# EAGLE board b0_comp (EAGLE 6.4), part 1 of 2
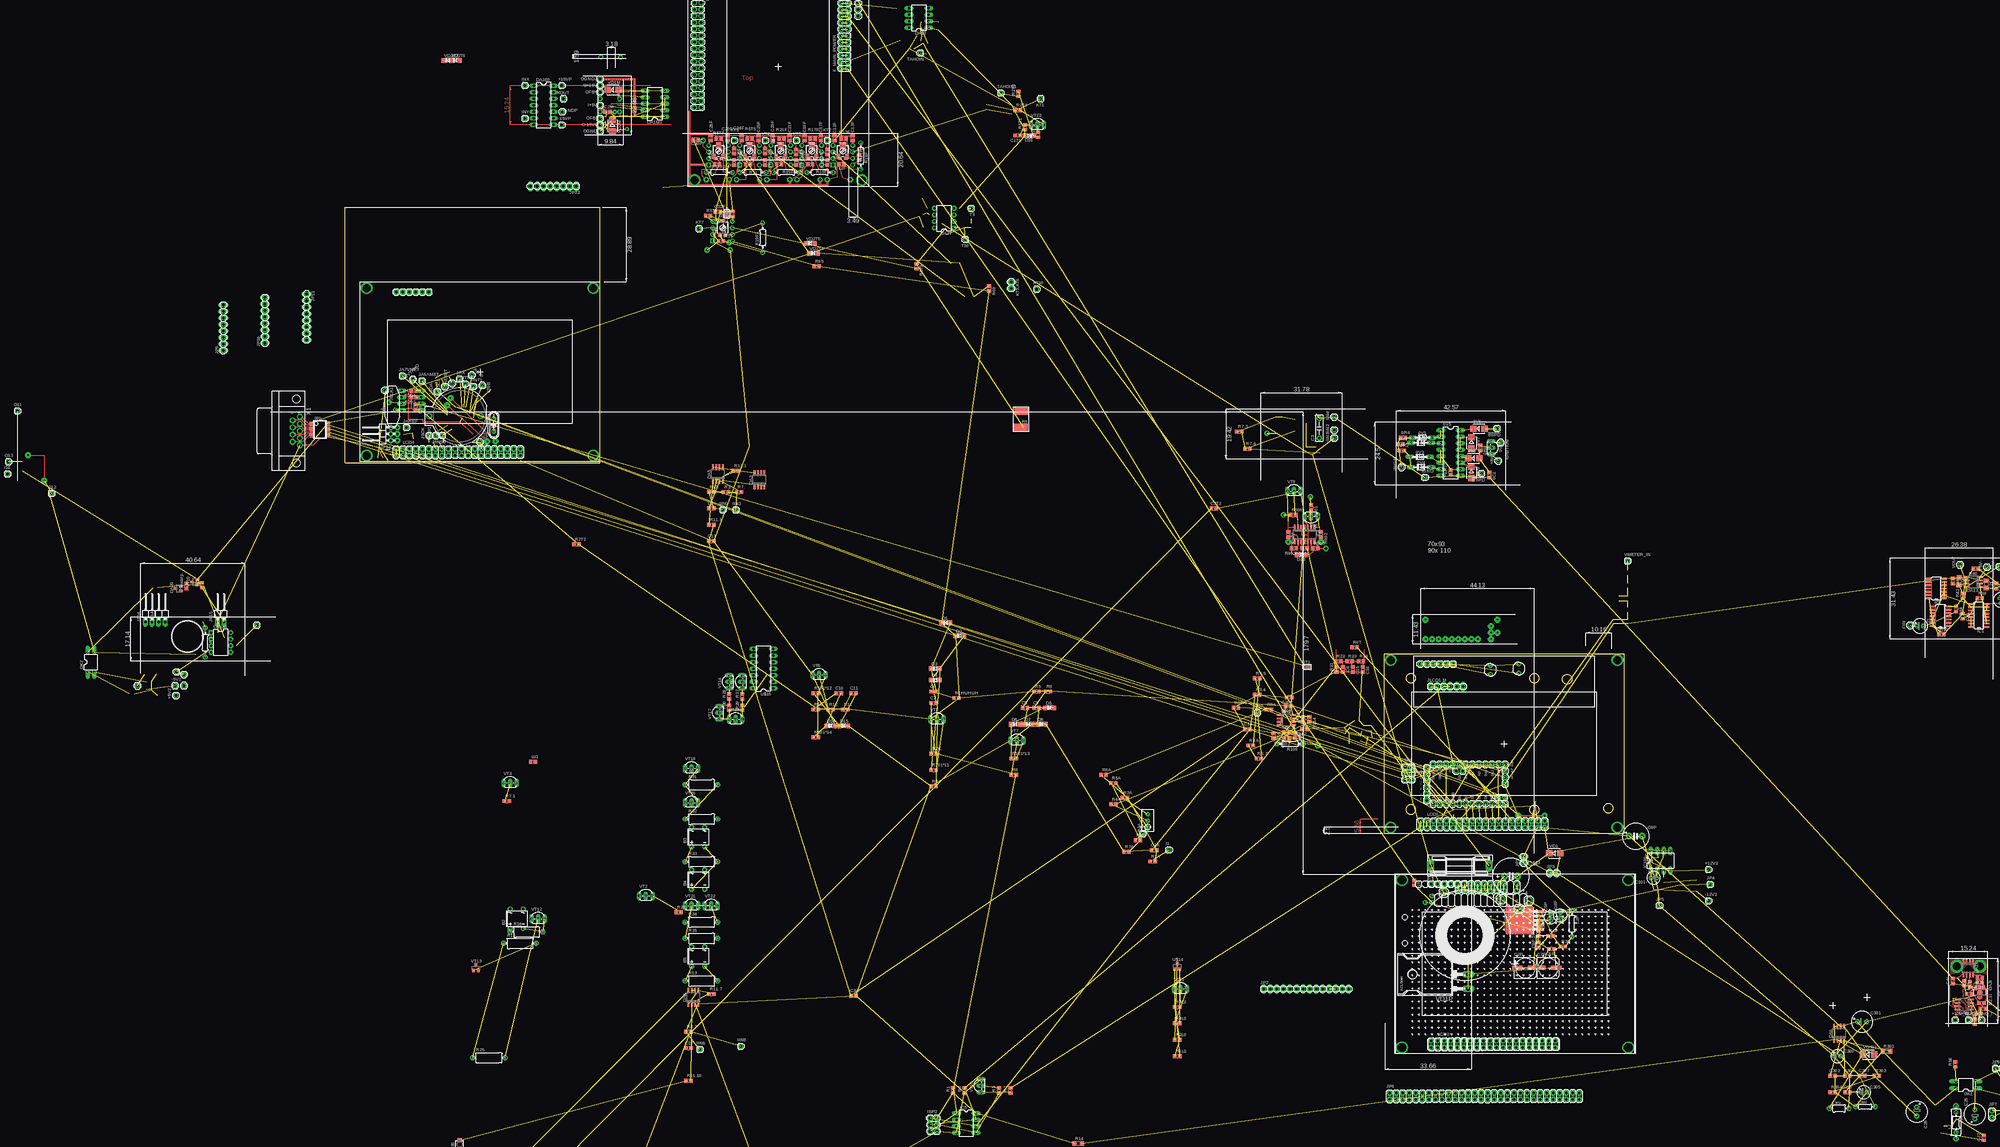
[diagram p12: board, top side]
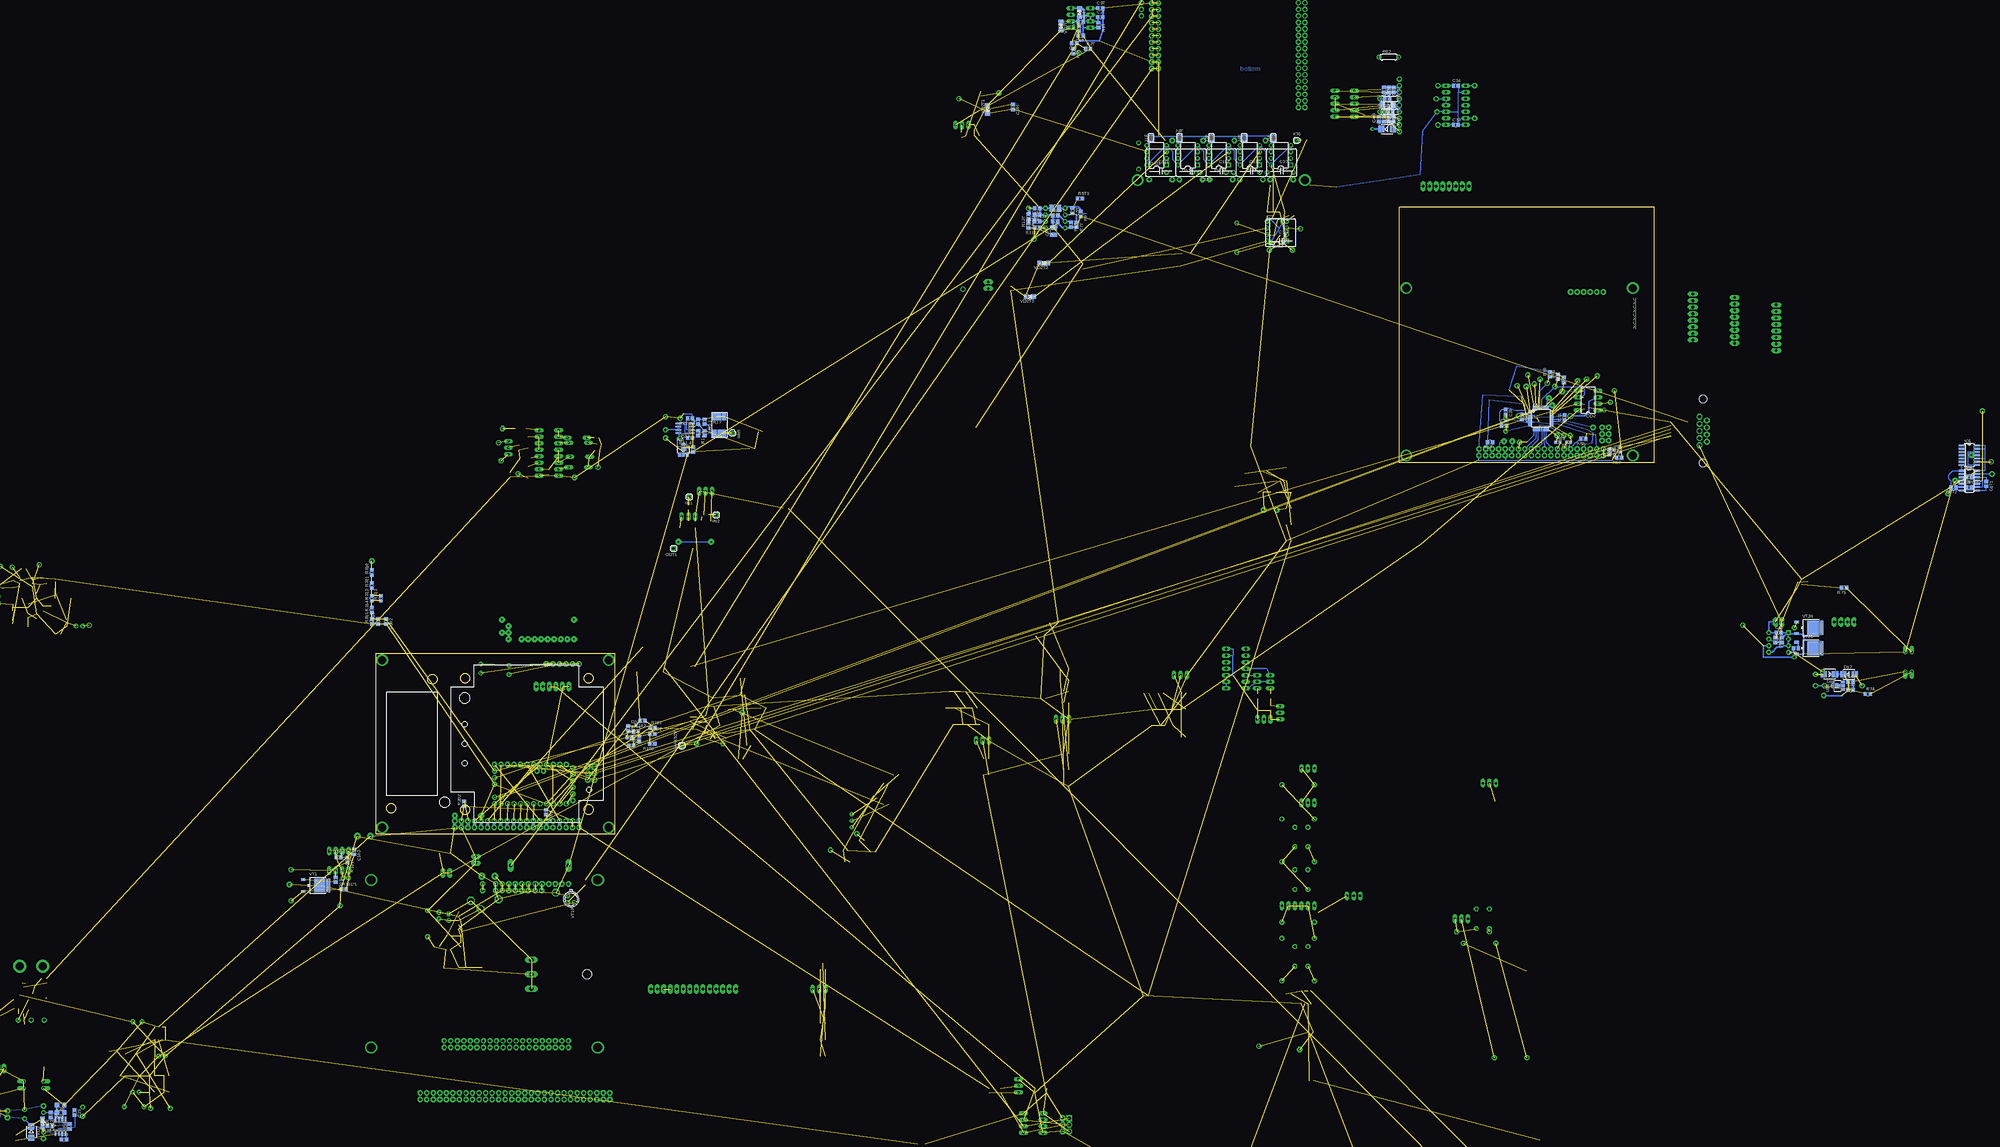
[diagram p13: board, bottom side, seen from below]

Size 496.72 x 243.28 mm. Coordinates in mm from the lower left corner, seen from the top.
Outline: 403.72,70 496.72,70 496.72,0 403.72,0 403.72,70
Outline: circle at 474.72,60 radius 1.8
Outline: circle at 490.72,10 radius 1.8
Outline: circle at 414.02,9.5 radius 1.8
Outline: circle at 414.02,60.5 radius 1.8
Outline: circle at 462.02,60.5 radius 1.8
Outline: circle at 461.91,9.38 radius 1.8
Copper layers (1*16): Top 0.035mm / dielectric 1.5mm / Bottom 0.035mm
Design rules "DesignRules": minimum track width 8mil, minimum drill 24mil, track to track 0.2mm, track to pad 0.2mm, pad to pad 8mil, via to via 8mil, smd to smd 8mil, copper to edge 10mil, drill to drill 8mil, minimum pad ring 0.5mm, minimum via ring 8mil, stop-mask expansion 4mil, vias tented up to drill 0mil, thermal gap 10mil

## Footprints (pad centres in the part's own frame; a part is rotated, then mirrored left to right if it is on the bottom)
C0805 = smd 1.3 x 1.5: 1 -0.95,0; 2 0.95,0
R0805 = smd 1.3 x 1.5: 1 -0.95,0; 2 0.95,0
DO34Z7 = drill 0.813 long: A 3.81,0; C -3.81,0
DIL16 = drill 0.813 long: 1 -8.89,-3.81; 2 -6.35,-3.81; 3 -3.81,-3.81; 4 -1.27,-3.81; 5 1.27,-3.81; 6 3.81,-3.81; 7 6.35,-3.81; 8 8.89,-3.81; 9 8.89,3.81; 10 6.35,3.81; 11 3.81,3.81; 12 1.27,3.81; 13 -1.27,3.81; 14 -3.81,3.81; 15 -6.35,3.81; 16 -8.89,3.81
SMB = smd 2.4 x 2.4: A 2.2,0; C -2.2,0
TO92 = drill 0.813 long: 1 -2.54,-1.27; 2 0,-1.27; 3 2.54,-1.27
PIN-2MM = drill 2 octagon: 1 0,0
1X01 = drill 1.016 octagon: 1 0,0
2X01 = drill 1.016 octagon: 1 -1.27,-1.27; 2 -1.27,1.27
ARDUINO_PRO_MINI = drill 1: A0 11.43,-8.89; A1 11.43,-6.35; A2 11.43,-3.81; A3 11.43,-1.27; A4 8.89,-2.54; A5 8.89,0; A6 6.35,-19.05; A7 8.89,-19.05; BLK 10.16,11.43; D2 -3.81,-1.27; D3 -3.81,-3.81; D4 -3.81,-6.35; D5 -3.81,-8.89; D6 -3.81,-11.43; D7 -3.81,-13.97; D8 -3.81,-16.51; D9 -3.81,-19.05; D10 11.43,-19.05; D11 11.43,-16.51; D12 11.43,-13.97; D13 11.43,-11.43; DTR -2.54,11.43; GND -3.81,1.27; GND@1 11.43,6.35; GND@2 7.62,11.43; GND@3 3.81,-19.05; RAW 11.43,8.89; RST 11.43,3.81; RST@1 -3.81,3.81; RX -3.81,6.35; RX@1 2.54,11.43; TX -3.81,8.89; TX@1 0,11.43; VCC 11.43,1.27; VCC@1 5.08,11.43
DB = drill 0.813: + -2.54,-3.81 | drill 0.813 octagon: - 2.54,-3.81; AC1 2.54,3.81; AC2 -2.54,3.81
BATTERY-AA = drill 1.854: GND@1 25.146,0; GND@2 17.78,0; PWR@1 -25.146,0; PWR@2 -17.78,0
BATTCOM_20MM_PTH = drill 1.3: 1 11.85,0; 2 -8.15,0
E5-13 = drill 1.016 pad 2.54: + -2.54,0 | drill 1.016 pad 2.54 octagon: - 2.54,0
153CLV-0807 = smd 4 x 1.6: + 3.05,0; - -3.05,0
C075-032X103 = drill 0.914 octagon: 1 -3.81,0; 2 3.81,0
E2,5-5 = drill 0.813 pad 1.6: + -1.27,0 | drill 0.813 pad 1.6 octagon: - 1.27,0
C3225 = smd 1.6 x 2.7: 1 -1.4,0; 2 1.4,0
E5-10,5 = drill 1.016 pad 2.54: + -2.54,0 | drill 1.016 pad 2.54 octagon: - 2.54,0
C90-065X115H = drill 1.016 octagon: 1 -4.44,-0.002; 2 4.52,-0.002
C1206 = smd 1.6 x 1.8: 1 -1.4,0; 2 1.4,0
E2,5-6 = drill 0.813 pad 1.6: + -1.27,0 | drill 0.813 pad 1.6 octagon: - 1.27,0
E3,5-8 = drill 0.813 pad 1.6: + -1.778,0 | drill 0.813 pad 1.6 octagon: - 1.778,0
E2-5 = drill 0.813 pad 1.27: + -1.016,0 | drill 0.813 pad 1.27 octagon: - 1.016,0
SOD80C = smd 1.4 x 1.8: A 1.7,0; C -1.7,0
SOT-23 = smd 1 x 1.4: 1 -0.95,-1.1; 2 0.95,-1.1; 3 0,1.1
DIL8 = drill 0.813 square: 1 -3.81,-3.81 | drill 0.813: 2 -1.27,-3.81; 3 1.27,-3.81; 4 3.81,-3.81; 5 3.81,3.81; 6 1.27,3.81; 7 -1.27,3.81; 8 -3.81,3.81
SOIC8 = smd 0.6 x 2.2: 1 -1.905,-2.6; 2 -0.635,-2.6; 3 0.635,-2.6; 4 1.905,-2.6; 5 1.905,2.6; 6 0.635,2.6; 7 -0.635,2.6; 8 -1.905,2.6
MSOP10 = smd 0.3 x 1.02: 1 -1,-2.4; 2 -0.5,-2.4; 3 0,-2.4; 4 0.5,-2.4; 5 1,-2.4; 6 1,2.4; 7 0.5,2.4; 8 0,2.4; 9 -0.5,2.4; 10 -1,2.4
DIL10 = drill 0.813 long: 1 -5.08,-3.81; 2 -2.54,-3.81; 3 0,-3.81; 4 2.54,-3.81; 5 5.08,-3.81; 6 5.08,3.81; 7 2.54,3.81; 8 0,3.81; 9 -2.54,3.81; 10 -5.08,3.81
TO263-5 = smd 1.067 x 2.159: 1 -3.404,-5.791; 2 -1.702,-5.791; 3 0,-5.791; 4 1.702,-5.791; 5 3.404,-5.791 | smd 10.8 x 10.41: 6 0,2.54
DIL-08 = drill 0.813 long: 1 -3.81,-3.81; 2 -1.27,-3.81; 3 1.27,-3.81; 4 3.81,-3.81; 5 3.81,3.81; 6 1.27,3.81; 7 -1.27,3.81; 8 -3.81,3.81
SO08 = smd 0.6 x 2.2: 1 -1.905,-2.6; 2 -0.635,-2.6; 3 0.635,-2.6; 4 1.905,-2.6; 5 1.905,2.6; 6 0.635,2.6; 7 -0.635,2.6; 8 -1.905,2.6
DIL08 = drill 0.813 pad 1.27: 1 -3.81,-3.81; 2 -1.27,-3.81; 3 1.27,-3.81; 4 3.81,-3.81; 5 3.81,3.81; 6 1.27,3.81; 7 -1.27,3.81; 8 -3.81,3.81
SOT89 = smd 1 x 1.5: 1 -1.499,-1.981; 3 1.499,-1.981 | smd 1 x 2: 2 0,-1.727 | smd 2.2 x 3.7: 2@1 0,0.94
DIL14 = drill 0.813 long: 1 -7.62,-3.81; 2 -5.08,-3.81; 3 -2.54,-3.81; 4 0,-3.81; 5 2.54,-3.81; 6 5.08,-3.81; 7 7.62,-3.81; 8 7.62,3.81; 9 5.08,3.81; 10 2.54,3.81; 11 0,3.81; 12 -2.54,3.81; 13 -5.08,3.81; 14 -7.62,3.81
SSOP20D8 = smd 0.305 x 1.245: 1 -2.794,-3.353; 2 -2.159,-3.353; 3 -1.524,-3.353; 4 -0.889,-3.353; 5 -0.254,-3.353; 6 0.381,-3.353; 7 1.016,-3.353; 8 1.651,-3.353; 9 2.286,-3.353; 10 2.921,-3.353; 11 2.921,3.251; 12 2.286,3.251; 13 1.651,3.251; 14 1.016,3.251; 15 0.381,3.251; 16 -0.254,3.251; 17 -0.889,3.251; 18 -1.524,3.251; 19 -2.159,3.251; 20 -2.794,3.251
DIL08' = drill 0.813 long: 1 -3.81,-3.81; 2 -1.27,-3.81; 3 1.27,-3.81; 4 3.81,-3.81; 5 3.81,3.81; 6 1.27,3.81; 7 -1.27,3.81; 8 -3.81,3.81
SH22,5 = drill 1.321 pad 2.54 long: 1 -11.252,0; 2 11.252,0
2X14 = drill 1.016 octagon: 1 -16.51,-1.27; 1A -16.51,1.27; 2 -13.97,-1.27; 2A -13.97,1.27; 3 -11.43,-1.27; 3A -11.43,1.27; 4 -8.89,-1.27; 4A -8.89,1.27; 5 -6.35,-1.27; 5A -6.35,1.27; 6 -3.81,-1.27; 6A -3.81,1.27; 7 -1.27,-1.27; 7A -1.27,1.27; 8 1.27,-1.27; 8A 1.27,1.27; 9 3.81,-1.27; 9A 3.81,1.27; 10 6.35,-1.27; 10A 6.35,1.27; 11 8.89,-1.27; 11A 8.89,1.27; 12 11.43,-1.27; 12A 11.43,1.27; 14 16.51,-1.27; 14A 16.51,1.27
SO16 = smd 0.66 x 2.032: 1 -4.445,-3.073; 2 -3.175,-3.073; 3 -1.905,-3.073; 4 -0.635,-3.073; 5 0.635,-3.073; 6 1.905,-3.073; 7 3.175,-3.073; 8 4.445,-3.073; 9 4.445,3.073; 10 3.175,3.073; 11 1.905,3.073; 12 0.635,3.073; 13 -0.635,3.073; 14 -1.905,3.073; 15 -3.175,3.073; 16 -4.445,3.073
SO14 = smd 0.66 x 2.032: 1 -3.81,-3.073; 2 -2.54,-3.073; 3 -1.27,-3.073; 4 0,-3.073; 5 1.27,-3.073; 6 2.54,-3.073; 7 3.81,-3.073; 8 3.81,3.073; 9 2.54,3.073; 10 1.27,3.073; 11 0,3.073; 12 -1.27,3.073; 13 -2.54,3.073; 14 -3.81,3.073
SO14' = smd 0.6 x 2.2: 1 -3.81,-2.6; 2 -2.54,-2.6; 3 -1.27,-2.6; 4 0,-2.6; 5 1.27,-2.6; 6 2.54,-2.6; 7 3.81,-2.6; 8 3.81,2.6; 9 2.54,2.6; 10 1.27,2.6; 11 0,2.6; 12 -1.27,2.6; 13 -2.54,2.6; 14 -3.81,2.6
TQFP32-08 = smd 1.27 x 0.559: 1 -4.293,2.8; 2 -4.293,2; 3 -4.293,1.2; 4 -4.293,0.4; 5 -4.293,-0.4; 6 -4.293,-1.2; 7 -4.293,-2; 8 -4.293,-2.8; 17 4.293,-2.8; 18 4.293,-2; 19 4.293,-1.2; 20 4.293,-0.4; 21 4.293,0.4; 22 4.293,1.2; 23 4.293,2; 24 4.293,2.8 | smd 0.559 x 1.27: 9 -2.8,-4.293; 10 -2,-4.293; 11 -1.2,-4.293; 12 -0.4,-4.293; 13 0.4,-4.293; 14 1.2,-4.293; 15 2,-4.293; 16 2.8,-4.293; 25 2.8,4.293; 26 2,4.293; 27 1.2,4.293; 28 0.4,4.293; 29 -0.4,4.293; 30 -1.2,4.293; 31 -2,4.293; 32 -2.8,4.293
CONN-2X03 = drill 1.2 pad 1.829 square: 1 0,0 | drill 1.2 pad 1.829 octagon: 2 2.54,0; 3 0,-2.54; 4 2.54,-2.54; 5 0,-5.08; 6 2.54,-5.08
SJ = smd 1.168 x 1.6: 1 -0.762,0; 2 0.762,0
1X06 = drill 1.016 long: 1 -6.35,0; 2 -3.81,0; 3 -1.27,0; 4 1.27,0; 5 3.81,0; 6 6.35,0
1X02 = drill 1.016 long: 1 -1.27,0; 2 1.27,0
1X14 = drill 1.016 long: 1 -16.51,0; 2 -13.97,0; 3 -11.43,0; 4 -8.89,0; 5 -6.35,0; 6 -3.81,0; 7 -1.27,0; 8 1.27,0; 9 3.81,0; 10 6.35,0; 11 8.89,0; 12 11.43,0; 13 13.97,0; 14 16.51,0
2X30 = drill 1.016 octagon: 1 -38.1,-1.27; 2 -38.1,1.27; 3 -35.56,-1.27; 4 -35.56,1.27; 5 -33.02,-1.27; 6 -33.02,1.27; 7 -30.48,-1.27; 8 -30.48,1.27; 9 -27.94,-1.27; 10 -27.94,1.27; 11 -25.4,-1.27; 12 -25.4,1.27; 13 -22.86,-1.27; 14 -22.86,1.27; 15 -20.32,-1.27; 16 -20.32,1.27; 17 -17.78,-1.27; 18 -17.78,1.27; 19 -15.24,-1.27; 20 -15.24,1.27; 21 -12.7,-1.27; 22 -12.7,1.27; 23 -10.16,-1.27; 24 -10.16,1.27; 25 -7.62,-1.27; 26 -7.62,1.27; 27 -5.08,-1.27; 28 -5.08,1.27; 29 -2.54,-1.27; 30 -2.54,1.27; 31 0,-1.27; 32 0,1.27; 33 2.54,-1.27; 34 2.54,1.27; 35 5.08,-1.27; 36 5.08,1.27; 37 7.62,-1.27; 38 7.62,1.27; 39 10.16,-1.27; 40 10.16,1.27; 41 12.7,-1.27; 42 12.7,1.27; 43 15.24,-1.27; 44 15.24,1.27; 45 17.78,-1.27; 46 17.78,1.27; 47 20.32,-1.27; 48 20.32,1.27; 49 22.86,-1.27; 50 22.86,1.27; 51 25.4,-1.27; 52 25.4,1.27; 53 27.94,-1.27; 54 27.94,1.27; 55 30.48,-1.27; 56 30.48,1.27; 57 33.02,-1.27; 58 33.02,1.27; 59 35.56,-1.27; 60 35.56,1.27
1X05 = drill 1.016 long: 1 -5.08,0; 2 -2.54,0; 3 0,0; 4 2.54,0; 5 5.08,0
1X08 = drill 1.016 long: 1 -8.89,0; 2 -6.35,0; 3 -3.81,0; 4 -1.27,0; 5 1.27,0; 6 3.81,0; 7 6.35,0; 8 8.89,0
2X03/90 = drill 1.016 octagon: 1 -2.54,-6.35; 2 -2.54,-3.81; 3 0,-6.35; 4 0,-3.81; 5 2.54,-6.35; 6 2.54,-3.81
1X02/90 = drill 1.016 long: 1 -1.27,-3.81; 2 1.27,-3.81
TFI0305 = drill 0.9 pad 1.5: 1 -3.81,0; 2 3.81,0
0207/7 = drill 0.813 octagon: 1 -3.81,0; 2 3.81,0
TFI0410 = drill 1 pad 1.6: 1 -6.35,0; 2 6.35,0
0207/10 = drill 0.813 octagon: 1 -5.08,0; 2 5.08,0
0204/7 = drill 0.813 octagon: 1 -3.81,0; 2 3.81,0
12864B = drill 1.016 octagon: 1 15.76,-32.5; 1@ 15.76,-29.96; 2 13.22,-32.5; 2@ 13.22,-29.96; 3 10.68,-32.5; 3@ 10.68,-29.96; 4 8.14,-32.5; 4@ 8.14,-29.96; 5 5.6,-32.5; 5@ 5.6,-29.96; 6 3.06,-32.5; 6@ 3.06,-29.96; 7 0.52,-32.5; 7@ 0.52,-29.96; 8 -2.02,-32.5; 8@ -2.02,-29.96; 9 -4.56,-32.5; 9@ -4.56,-29.96; 10 -7.1,-32.5; 10@ -7.1,-29.96; 11 -9.64,-32.5; 11@ -9.64,-29.96; 12 -12.18,-32.5; 12@ -12.18,-29.96; 13 -14.72,-32.5; 13@ -14.72,-29.96; 14 -17.26,-32.5; 14@ -17.26,-29.96; 15 -19.8,-32.5; 15@ -19.8,-29.96; 16 -22.34,-32.5; 16@ -22.34,-29.96; 17 -24.88,-32.5; 17@ -24.88,-29.96; 18 -27.42,-32.5; 18@ -27.42,-29.96; 19 -29.96,-32.5; 19@ -29.96,-29.96; 20 -32.5,-32.5; 20@ -32.5,-29.96; 21 -32.5,31; 22 -29.96,31; 23 -27.42,31; 24 -24.88,31; 25 -22.34,31; 26 -19.8,31 | drill 3.2 pad 4: P$1 -44,32.5; P$2 44,32.5; P$3 44,-32.5; P$4 -44,-32.5
DIL04 = drill 0.813 offset: 1 -1.27,-3.81; 2 1.27,-3.81; 3 1.27,3.81; 4 -1.27,3.81
PCB_DC-DC = drill 1.016 octagon: 1 -22.34,28.46; 1@ -22.34,31; 2 -19.8,28.46; 2@ -19.8,31; 3 -17.26,28.46; 3@ -17.26,31; 4 -14.72,28.46; 4@ -14.72,31; 5 -12.18,28.46; 5@ -12.18,31; 6 -9.64,28.46; 6@ -9.64,31; 7 -7.1,28.46; 7@ -7.1,31; 8 -4.56,28.46; 8@ -4.56,31; 10 0.52,28.46; 10@ 0.52,31 | drill 3.2 pad 4: P$1 -44,32.5; P$2 44,32.5; P$3 44,-32.5; P$4 -44,-32.5
HC49/S = drill 0.813: 1 -2.413,0; 2 2.413,0
R_O = drill 0.8: P$1 -1.75,0; P$2 1.75,0
RTRIM3296W = drill 0.61: 1 0,-2.54; 2 0,0; 3 0,2.54
PMA-A = smd 2.8 x 3.3: A 3.2,0.965; B -3.2,-0.965 | smd 2.8 x 1.6: SA 3.2,-1.829; SB -3.2,1.829
0411/12 = drill 0.914 octagon: 1 -6.35,0; 2 6.35,0
R1206 = smd 1.6 x 1.803: 1 -1.422,0; 2 1.422,0
0207/11 = drill 0.813 octagon: 1 -5.715,0; 2 5.715,0
RTRIM3202 = smd 0.9 x 1.3: 1 -0.95,-1.75; 3 0.95,-1.75 | smd 1.6 x 1.4: 2 0,1.6
RTRIM3314GJ = smd 1.3 x 1.3: 1 1.15,-2.75; 3 -1.15,-2.75 | smd 1.3 x 2: 1A 1.8,-2; 3A -1.8,-2 | smd 2 x 2.4: 2 0,2.2
RTRIM3314G = smd 1.3 x 1.3: 1 1.15,-2.75; 3 -1.15,-2.75 | smd 2 x 1.3: 2 0,2.75
R0603 = smd 1 x 1.1: 1 -0.85,0; 2 0.85,0
PIN_D3MM = drill 3 pad 5: P$1 0,0
PIN1X1N = drill 1.016 octagon: 1 0,0
TO247H = drill 1.6 long: 1 -5.588,-7.62; 2 0,-7.62; 3 5.588,-7.62 | hole 3.607: 0,13.97
DPACK = smd 5.4 x 6.2: D 0,2.5 | smd 1 x 1.6: G -2.28,-4.8; S 2.28,-4.8
TO18 = drill 0.813 octagon: 1 -1.27,-1.27; 2 1.27,-1.27; 3 1.27,1.27
SOT23 = smd 1 x 1.4: 1 -0.95,-1.1; 2 0.95,-1.1; 3 0,1.1
182-009-MALE = drill 1.194 pad 1.524 octagon: 1 -5.537,10.923; 2 -2.769,10.923; 3 0,10.923; 4 2.769,10.923; 5 5.537,10.923; 6 -4.153,8.08; 7 -1.384,8.08; 8 1.384,8.08; 9 4.153,8.08 | hole 3.048: -12.446,9.501; 12.446,9.501
FC-12M = drill 0.8: P$1 1.5,1.2; P$2 -1.5,-1.2

## Placement (x,y rotation side)
0C1  100n  [C0805]  444.47,139.42 270 top
0R2  [R0805]  410.47,148.92 0 top
0R3  [R0805]  409.97,151.42 0 top
0R4  [R0805]  410.97,153.92 0 top
0R6  10k  [R0805]  440.97,149.92 270 top
0R7  [R0805]  429.47,140.42 90 top
0V1  5v  [DO34Z7]  418.47,153.92 0 top
0V2  8v  [DO34Z7]  417.97,151.92 0 top
0V3  11v  [DO34Z7]  417.47,146.42 0 top
0V4  11.5v  [DO34Z7]  417.97,142.42 0 top
0V5  К1109КТ22  [DIL16]  429.47,147.92 270 top
0V6  [SMB]  440.47,157.42 0 top
0V7  [SMB]  437.47,151.92 270 top
0V8  [SMB]  438.47,145.92 0 top
0V9  [SMB]  437.47,140.42 270 top
0V10  П306ОС  [TO92]  446.47,149.92 270 top
1  T_PIN  [PIN-2MM]  not placed on the board
2  T_PIN  [PIN-2MM]  not placed on the board
3  T_PIN  [PIN-2MM]  not placed on the board
4  T_PIN  [PIN-2MM]  not placed on the board
!BSPD  [1X01]  447.47,157.42 180 top
!RSPD  [1X01]  441.47,139.92 180 top
+5V2  [1X01]  -65.72,53.73 90 top  (outside the outline)
+12V2  [1X01]  not placed on the board
+12V_I  [1X01]  625.48,-72.31 0 top  (outside the outline)
+15VP  [1X01]  84.14,290.59 0 top  (outside the outline)
+BAT  [1X01]  447.97,144.92 90 top
-5V2  [1X01]  -66.04,57.54 0 top  (outside the outline)
-12V2  [1X01]  not placed on the board
-15VP  [1X01]  84.14,275.35 0 top  (outside the outline)
A5  A4  [2X01]  449.22,15.5 90 top
ARDUINO1  [ARDUINO_PRO_MINI]  431.55,15.53 90 top
B2  [DB]  not placed on the board
B3  [DB]  137.16,-1.2 0 top
B4  [DB]  not placed on the board
B5  [DB]  not placed on the board
BT1  [BATTERY-AA]  not placed on the board
BT2  [BATTERY-AA]  not placed on the board
BT3  [BATTCOM_20MM_PTH]  44.45,162.32 180 top
C1  1m  [C0805]  142.24,126.44 0 top
C1I  1n  [C0805]  628.97,-58.03 270 top  (outside the outline)
C1P  2200m  [E5-13]  not placed on the board
C1T  100n  [C0805]  not placed on the board
C1T1  100n  [C0805]  not placed on the board
C2  1m  [C0805]  371.48,160.09 90 bottom
C2A  100n  [C0805]  not placed on the board
C2I  100n  [C0805]  635,-57.71 180 top  (outside the outline)
C2M  100n  [C0805]  101.92,280.43 0 top  (outside the outline)
C2P  220m 35v  [153CLV-0807]  not placed on the board
C2T  1m  [C0805]  215.27,317.26 0 bottom  (outside the outline)
C3  100n  [C075-032X103]  378.46,157.56 90 top
C3A  100n  [C0805]  not placed on the board
C3I  1m  [C0805]  635,-55.81 180 top  (outside the outline)
C3M  4p7  [C0805]  103.19,289 270 bottom  (outside the outline)
C3P  1m  [C0805]  not placed on the board
C3T  100n  [C0805]  215.27,320.75 0 bottom  (outside the outline)
C3T1  100n  [C0805]  not placed on the board
C3T2  470  [C0805]  337.5,126.44 0 top
C4  10n  [C0805]  387.67,63.89 270 top
C4I  100n  [C0805]  624.52,-57.08 90 top  (outside the outline)
C4M  100n  [C0805]  107,277.57 90 bottom  (outside the outline)
C4P  22m  [E2,5-5]  not placed on the board
C4T  100n  [C0805]  222.89,309.95 180 bottom  (outside the outline)
C5  1m  [C0805]  not placed on the board
C5M  1m  [C0805]  105.09,277.57 270 bottom  (outside the outline)
C5P  22m  [E2,5-5]  not placed on the board
C5T  1n  [C0805]  226.06,242.01 270 bottom
C6  [C0805]  228.6,55.32 0 top
C6M  100p  [C0805]  103.19,277.57 270 bottom  (outside the outline)
C6P  1m  [C0805]  not placed on the board
C7  [C0805]  228.6,50.88 0 top
C7M  1m  [C0805]  105.09,289 270 bottom  (outside the outline)
C7P  100m 50v  [153CLV-0807]  not placed on the board
C7T  10m  [C3225]  232.73,242.96 180 bottom
C8  100n  [C0805]  264.16,48.97 0 top
C8P  470m  [E5-10,5]  501.33,-0.88 0 top
C8T  100n  [C0805]  232.73,237.88 180 bottom
C8T1  220n  [C0805]  -128.9,135.97 270 bottom  (outside the outline)
C8T2  22n  [C0805]  -116.2,134.69 180 bottom  (outside the outline)
C9  100n  [C0805]  268.61,48.97 0 top
C9P  1m  [C0805]  not placed on the board
C9T  10m*  [C3225]  233.36,234.07 90 bottom
C10  100n  [C0805]  191.77,54.69 0 top
C10F  10n  [C0805]  not placed on the board
C11  100n  [C0805]  197.49,54.69 0 top
C11F  1m  [C90-065X115H]  191.77,254.07 180 bottom  (outside the outline)
C12  100n  [C0805]  373.38,149.3 90 bottom
C12F  1m  [C0805]  190.18,270.27 90 top  (outside the outline)
C13  100n  [C0805]  142.24,113.74 0 top
C13F  100n  [C0805]  197.17,270.27 90 top  (outside the outline)
C14  1m  [C0805]  350.52,40.72 0 top
C14F  10n  [C0805]  187.33,264.87 270 top  (outside the outline)
C15  10n  [C0805]  391.48,63.89 270 top
C15F  1m  [C90-065X115H]  180.02,254.07 180 bottom  (outside the outline)
C16  10n  [C0805]  395.29,63.89 270 top
C16F  1m  [C0805]  178.44,270.27 90 top  (outside the outline)
C17  1m  [C0805]  not placed on the board
C17F  100n  [C0805]  184.79,270.27 90 top  (outside the outline)
C18  470  [C0805]  617.86,-118.67 0 bottom  (outside the outline)
C18F  1n  [C0805]  175.26,264.87 270 top  (outside the outline)
C19  100n  [C0805]  not placed on the board
C19F  1m  [C90-065X115H]  168.28,254.07 180 bottom  (outside the outline)
C20  100n  [C0805]  not placed on the board
C20F  1m  [C0805]  166.05,270.27 90 top  (outside the outline)
C21  4m7  [C1206]  not placed on the board
C21F  100n  [C0805]  172.72,270.27 90 top  (outside the outline)
C22  [E2,5-6]  not placed on the board
C22F  10n  [C0805]  163.2,265.19 270 top  (outside the outline)
C23  4m7  [C1206]  not placed on the board
C23F  1m  [C90-065X115H]  156.53,254.07 180 bottom  (outside the outline)
C24  [E2,5-6]  not placed on the board
C24F  1m  [C0805]  153.99,270.27 270 top  (outside the outline)
C25  100n  [C0805]  613.73,-108.19 270 bottom  (outside the outline)
C25F  100n  [C0805]  160.66,270.27 90 top  (outside the outline)
C26  100m16v  [E3,5-8]  633.1,-108.83 90 top  (outside the outline)
C26F  10n  [C0805]  151.13,265.19 270 top  (outside the outline)
C27  100n  [C0805]  not placed on the board
C27F  1m  [C90-065X115H]  144.78,254.07 180 bottom  (outside the outline)
C28  470m  [E3,5-8]  610.55,-107.88 270 top  (outside the outline)
C28F  1m  [C0805]  141.92,270.27 90 top  (outside the outline)
C29  [C0805]  57.79,163.91 270 bottom
C29F  100n  [C0805]  148.59,270.27 90 top  (outside the outline)
C30  [C0805]  58.42,158.51 0 bottom
C30F  10n  [C0805]  not placed on the board
C31  [C0805]  34.93,161.68 90 bottom
C31F  1m  [C90-065X115H]  145.1,226.77 180 bottom
C32  [C0805]  51.44,162 270 bottom
C32F  1m  [C0805]  144.78,241.69 0 top
C33  [C0805]  77.15,275.35 0 bottom  (outside the outline)
C33F  100n  [C0805]  150.5,240.74 90 top
C34  [C0805]  77.15,290.59 0 bottom  (outside the outline)
C39  100p  [C0805]  -49.53,75.32 90 bottom  (outside the outline)
C40  100n  [C0805]  -48.26,78.18 0 bottom  (outside the outline)
C41  100n  [C0805]  -76.2,59.13 0 bottom  (outside the outline)
C42  100n  [C0805]  -76.2,55.95 0 bottom  (outside the outline)
C100  100n  [C0805]  366.4,49.61 180 top
C101-  4m7  [E2-5]  not placed on the board
C102  1n  [C0805]  393.07,43.89 180 bottom
C102-  100n  [C0805]  not placed on the board
C103  100n  [C0805]  365.76,36.91 180 top
C104  100n  [C0805]  360.68,38.17 270 top
C201  100n  [C0805]  366.71,52.96 180 top
C301  470m  [E3,5-8]  not placed on the board
C302  100n  [C0805]  492.72,82.5 270 bottom
C303  470  [C0805]  not placed on the board
C304  100n  [C0805]  not placed on the board
C305  100m  [E2,5-5]  not placed on the board
C306  100m  [E2,5-5]  not placed on the board
C307  100n  [C0805]  not placed on the board
D1  [SOD80C]  233.36,81.99 0 top
D2  [SOD80C]  238.76,76.91 0 top
D3  [SOD80C]  229.24,64.21 0 top
D4  [SOD80C]  229.24,59.77 0 top
D5  [SOD80C]  273.69,48.97 0 top
D6  [SOD80C]  260.35,42.62 0 top
D7  [SOD80C]  265.43,42.62 0 top
D8  [SOD80C]  270.51,42.62 0 top
D9  LL4148  [SOD80C]  not placed on the board
D13  [SOD80C]  371.48,108.34 180 top
D14  [SOD80C]  188.6,41.98 0 top
D15  [SOD80C]  193.68,41.98 0 top
D16  5v6  [SOD80C]  not placed on the board
D17  [SMB]  -75.56,61.99 0 bottom  (outside the outline)
D18  [SMB]  -67.94,61.99 180 bottom  (outside the outline)
DA1  TL432  [SOT-23]  395.72,41 0 bottom
DA1F  КР1006ВИ1  [DIL8]  193.36,263.6 90 bottom  (outside the outline)
DA1I  ACS712-20  [SOIC8]  630.56,-52 180 top  (outside the outline)
DA1M  LT1945EMS  [MSOP10]  103.51,282.97 90 bottom  (outside the outline)
DA1M1  [DIL10]  not placed on the board
DA1P  XL6009  [TO263-5]  not placed on the board
DA1T  555  [DIL-08]  222.89,316.94 90 top  (outside the outline)
DA2  AZ358  [SO08]  365.71,44.2 270 top
DA2F  КР1006ВИ1  [DIL8]  181.29,263.6 90 bottom  (outside the outline)
DA2I  LM2904  [SO08]  628.97,-66.28 90 top  (outside the outline)
DA2T  LM231N  [DIL08]  232.73,239.15 90 top
DA3  AZ358  [SO08]  160.97,137.55 0 top
DA3F  КР1006ВИ1  [DIL8]  169.23,263.6 90 bottom  (outside the outline)
DA3I  78L05F  [SOT89]  635,-61.52 180 top  (outside the outline)
DA4  BA358  [SO08]  376.56,157.56 90 bottom
DA4F  КР1006ВИ1  [DIL8]  157.16,263.6 90 bottom  (outside the outline)
DA5  AZ358  [SO08]  144.78,139.78 0 top
DA5F  КР1006ВИ1  [DIL8]  145.1,263.6 90 bottom  (outside the outline)
DA6  MC34063AD  [SOIC8]  not placed on the board
DA6F  КР1006ВИ1  [DIL8]  146.69,234.07 90 bottom
DA8  BA10358  [SO08]  not placed on the board
DA9  BA10358  [SO08]  not placed on the board
DA10  AZ358  [SO08]  not placed on the board
DA11  TL432  [SOT-23]  not placed on the board
DA12  MC34063AD  [SOIC8]  619.12,-113.59 0 bottom  (outside the outline)
DA13  TL072  [SO08]  not placed on the board
DA20  TL432  [SOT-23]  not placed on the board
DA100  КМ525ПС3Б  [DIL14]  77.15,282.97 270 top  (outside the outline)
DA148  КP1211ЕУ1  [DIL8]  -48.26,74.37 270 top  (outside the outline)
DD1-  GD75232DB  [SSOP20D8]  -9.71,157.1 270 top  (outside the outline)
DD2  DS1307  [DIL08']  25.79,168.36 90 bottom
F1  5A  [SH22,5]  not placed on the board
F5V  [1X01]  not placed on the board
F5V-  [1X01]  not placed on the board
F_MAIN_POWER  [2X14]  not placed on the board
FIN  [1X01]  not placed on the board
GND_I  [1X01]  635.63,-72.31 0 top  (outside the outline)
GNDP  [1X01]  84.46,280.43 270 top  (outside the outline)
I0  [1X01]  309.88,0.08 0 top
I1  [1X01]  not placed on the board
I10  [1X01]  -131.13,139.78 0 top  (outside the outline)
I+5V  [1X01]  99.06,282.97 0 top  (outside the outline)
IC1  4052D  [SO16]  not placed on the board
IC2  4070D  [SO14]  -122.24,137.24 270 bottom  (outside the outline)
IC3  78L09F  [SOT89]  377.19,149.3 0 bottom
IC5  ATtiny13A  [DIL08']  not placed on the board
IC6  74HC74D  [SO14]  -122.24,147.08 270 bottom  (outside the outline)
IC7  74HC14D  [SO14]  not placed on the board
IC8  74HC74D  [SO14]  not placed on the board
IC9  LM324D  [SO14']  372.75,116.28 180 top
IC12  MEGA8-AI  [TQFP32-08]  44.13,161.37 0 bottom
IC100  КР1006ВИ1(NE555)  [DIL-08]  not placed on the board
IGND  [1X01]  419.47,138.42 0 top
IGNITION  [1X01]  448.97,151.92 270 top
IIN0  [1X01]  146.69,125.81 0 top
IIN1  [1X01]  151.77,125.81 0 top
IIN2  [1X01]  384.18,156.92 90 top
IIN3  [1X01]  384.18,153.75 90 top
IIN4  [1X01]  384.18,162 90 top
IIN5  [1X01]  358.14,155.65 270 bottom
IIN6  [1X01]  not placed on the board
IIN7  [1X01]  354.33,47.06 0 top
IIN8  [1X01]  not placed on the board
IIN9  [1X01]  not placed on the board
IIN10  [1X01]  not placed on the board
IIN11  [1X01]  not placed on the board
IIN12  [1X01]  not placed on the board
IN1  [1X01]  374.97,130.88 180 bottom
IN2  [1X01]  364.49,123.9 180 bottom
INIGN  [1X01]  410.35,142.4 90 top
INX  [1X01]  69.85,290.59 0 top  (outside the outline)
INY  [1X01]  69.85,277.89 0 top  (outside the outline)
ISP1  [CONN-2X03]  411.81,26.06 0 top
ISP2  [CONN-2X03]  not placed on the board
J1F  [SJ]  195.58,270.27 90 bottom  (outside the outline)
J2F  [SJ]  184.47,270.27 90 bottom  (outside the outline)
J3F  [SJ]  172.09,270.27 90 bottom  (outside the outline)
J4F  [SJ]  159.39,270.27 90 bottom  (outside the outline)
J5F  [SJ]  147.96,270.27 90 bottom  (outside the outline)
J6F  [SJ]  148.27,240.74 90 top
JA6AMET  [1X01]  29.85,175.97 0 top
JA7VMET  [1X01]  22.23,177.88 0 top
JAREF  [1X01]  23.81,157.87 0 top
JBLK1  [1X01]  15.56,172.16 270 top
JICP1  [1X01]  35.24,154.7 90 top
JINT0  [1X01]  49.21,178.19 315 top
JINT1  [1X01]  49.85,173.75 0 top
JLCD1.M  [1X06]  427.99,57.23 0 top
JMISO  [1X01]  37.78,154.7 180 top
JP1  [1X02]  not placed on the board
JP2  [1X14]  not placed on the board
JP3  [1X02]  not placed on the board
JP4  [1X01]  not placed on the board
JP5  [1X01]  not placed on the board
JP6  [2X30]  not placed on the board
JP7  [2X01]  641.03,-108.83 0 top  (outside the outline)
JP8  [1X05]  not placed on the board
JP9  [1X08]  not placed on the board
JP10  [1X08]  not placed on the board
JP11  [1X08]  not placed on the board
JP12  [1X08]  not placed on the board
JP13  [2X03/90]  13.97,155.33 90 top
JP14  [1X02/90]  not placed on the board
JP15  [1X02/90]  -48.26,86.12 0 top  (outside the outline)
JP16  [1X02/90]  not placed on the board
JRESET  [1X01]  41.59,175.02 90 top
JRX  [1X01]  44.45,176.6 0 top
JSCK  [1X01]  32.7,154.7 90 top
JSCL  [1X01]  38.74,173.75 90 top
JSDA  [1X01]  35.88,171.84 90 top
JT0B  [1X01]  53.34,174.06 270 top
JT1  [SJ]  373.7,64.84 0 top
JT1B  [1X01]  52.39,152.16 225 top
JTX  [1X01]  46.67,174.7 0 top
JVTAHO  [1X01]  26.35,176.6 45 top
KOUT  [1X01]  84.77,285.51 0 top  (outside the outline)
KT1  [1X01]  not placed on the board
KT2  [1X01]  187.33,269.31 0 top  (outside the outline)
KT3  [1X01]  175.26,269.31 0 top  (outside the outline)
KT4  [1X01]  163.2,269.31 0 top  (outside the outline)
KT5  [1X01]  151.13,269.31 0 top  (outside the outline)
KT5,KT6  [1X02]  258.76,213.12 270 top
KT6  [1X01]  139.07,269.31 0 bottom  (outside the outline)
KT7  [1X01]  137.48,235.03 0 top
KT10  [1X01]  268.61,211.53 0 top
L1  100mkhn  [TFI0305]  625.79,-112 270 top  (outside the outline)
L1M  [0207/7]  102.87,285.51 180 bottom  (outside the outline)
L1P  T80-52 20w  [R23X14]  not placed on the board
L2  [TFI0410]  625.79,-112 90 top  (outside the outline)
L2M  murata LQH3C100  [0207/7]  102.87,280.43 180 bottom  (outside the outline)
L2P  [0207/10]  not placed on the board
L301  100mkhn  [TFI0305]  not placed on the board
L302  100mkhn  [0204/7]  not placed on the board
LCD1  LCD_128x64_ST7920  [12864B]  450.22,35 0 top
LCD2  LCD_128x64_ST7920  [12864B]  not placed on the board
LCD3  LCD_128x64_ST7920  [12864B]  not placed on the board
LCD4  LCD_128x64_ST7920  [12864B]  52.39,179.46 0 top
MAX52V  [1X01]  377.83,34.37 90 bottom
O11  [1X01]  not placed on the board
O12  [1X01]  not placed on the board
O13  [1X01]  not placed on the board
O+15V  [1X01]  99.06,290.59 0 top  (outside the outline)
O-15V1  [1X01]  not placed on the board
OFB+  [1X01]  99.06,288.05 0 top  (outside the outline)
OFB-  [1X01]  not placed on the board
OGND  [1X01]  not placed on the board
OGND2  [1X01]  99.06,293.13 0 top  (outside the outline)
OK1  PC817  [DIL04]  not placed on the board
OK2  LTV816  [DIL04]  not placed on the board
OUT1  [1X01]  381,110.88 180 bottom
OUT_I  [1X01]  630.56,-72.31 0 top  (outside the outline)
PCB_DC-DC  PCB_DC-DC  [PCB_DC-DC]  not placed on the board
Q2  [HC49/S]  57.79,158.82 90 top
R1  [R0805]  not placed on the board
R1A  100  [R0805]  not placed on the board
R1HUHUH  1k  [R0805]  237.49,52.78 0 top
R1I  20k  [R0805]  631.19,-58.34 90 top  (outside the outline)
R1L  5506  [R_O]  444.88,63.7 270 top
R1L0  100k  [R0805]  not placed on the board
R1P  10k  [R0805]  not placed on the board
R1T  1k  [R0805]  not placed on the board
R2  10k  [R0805]  not placed on the board
R2.1I  15.7k*  [R0805]  635.63,-65.65 0 top  (outside the outline)
R2.2I  [R0805]  not placed on the board
R2A  3k8  [R0805]  302.9,14.05 0 top
R2I1  20k  [R0805]  630.87,-62.16 0 top  (outside the outline)
R2K,  1k  [R0805]  228.6,31.19 0 top
R2L  5506  [R_O]  455.93,64.21 270 top
R2L0  100k  [R0805]  not placed on the board
R2P  10k  [R0805]  not placed on the board
R2T  10k  [R0805]  not placed on the board
R2T1  5k  [R0805]  not placed on the board
R2T2  10k  [R0805]  89.85,112.47 0 top
R2T3  2k7  [R0805]  not placed on the board
R2T4  10k  [R0805]  not placed on the board
R3  1k  [R0805]  not placed on the board
R3.  10  [R0805]  147.96,132.79 0 top
R3.1  10  [R0805]  368.94,160.09 270 bottom
R3.2  10  [R0805]  not placed on the board
R3.4  10k  [R0805]  354.33,54.05 0 top
R3.5  10k  [R0805]  354.33,60.4 0 top
R3.6  1k2  [R0805]  351.79,34.37 0 top
R3.7  560  [R0805]  354.97,29.29 0 top
R3.8  10  [R0805]  not placed on the board
R3.9  4k6*  [R0805]  not placed on the board
R3.10  10  [R0805]  not placed on the board
R3.11  1k  [R0805]  not placed on the board
R3.14  502  [R0805]  not placed on the board
R3.16  38k8  [R0805]  not placed on the board
R3A  400  [RTRIM3296W]  311.79,5.16 0 top
R3I  56k*  [R0805]  636.27,-67.87 0 top  (outside the outline)
R3I1  10k  [R0805]  not placed on the board
R3I2  10k  [R0805]  not placed on the board
R3L0  100k  [R0805]  not placed on the board
R3P  3.252k*  [R0805]  not placed on the board
R3T  5k1  [R0805]  222.89,315.35 0 bottom  (outside the outline)
R4  1k  [R0805]  228.6,18.49 0 top
R4A  47k  [R0805]  298.45,11.5 0 top
R4L0  1k  [R0805]  not placed on the board
R4P  1.050k*  [R0805]  not placed on the board
R4T  5k1  [R0805]  not placed on the board
R5  1k  [R0805]  268.61,55.32 0 top
R5A  6k8  [R0805]  298.45,19.76 0 top
R5T  51k  [R0805]  215.9,314.08 270 bottom  (outside the outline)
R5T1  10k  [R0805]  not placed on the board
R5T2  0  [R0805]  not placed on the board
R5T3  1M  [R0805]  163.2,260.74 270 top  (outside the outline)
R5T5  10k  [R0805]  157.16,269.95 0 top  (outside the outline)
R5T6  1M  [R0805]  151.13,260.74 270 top  (outside the outline)
R5T7  10k  [R0805]  145.1,269.95 0 top  (outside the outline)
R5T8  1M  [R0805]  140.97,240.1 0 top
R5T9  10k  [R0805]  221.93,220.42 270 top
R5T13  200k  [R0805]  156.53,260.11 0 top  (outside the outline)
R5T14  200k  [R0805]  144.46,260.11 0 top  (outside the outline)
R5T15  200k  [R0805]  146.05,230.26 0 top
R6  1k  [R0805]  273.05,55.32 0 top
R6A  100  [R0805]  307.98,-2.47 0 top
R6T  0  [R0805]  392.11,72.47 0 top
R7  68  [R0805]  not placed on the board
R7.  1k  [R0805]  153.04,132.79 0 top
R7.1  10k  [R0805]  62.87,12.77 0 top
R7.2  1k2  [R0805]  368.94,155.65 90 bottom
R7.3  470k  [R0805]  347.35,156.28 0 top
R7.4  470k  [R0805]  350.52,149.62 0 top
R7.5  1k  [R0805]  not placed on the board
R7A  15k  [R0805]  not placed on the board
R7T  10k  [R0805]  224.47,236.61 270 bottom
R8  10k  [R0805]  259.72,22.94 0 top
R8A  15k  [R0805]  294.64,22.94 0 top
R8T  10k  [R0805]  226.7,236.61 270 bottom
R9  [PMA-A]  262.57,161.05 90 top
R9A  510*  [R0805]  358.78,48.34 0 top
R9T  6k81  [R0805]  222.89,240.74 270 bottom
R10  1k  [R0805]  182.88,48.34 0 top
R10A  1k  [R0805]  346.08,48.97 0 top
R10T  51k  [R0805]  232.73,240.1 0 bottom
R11  1k  [R0805]  194.31,48.34 0 top
R11.  1k  [R0805]  142.24,132.79 0 top
R11.1  43.4k*  [R0805]  151.77,141.05 0 top
R11.2  1k2  [R0805]  374.65,161.37 180 bottom
R11.3  465.4k*  [R0805]  371.48,155.65 270 bottom
R11.4  143*  [R0805]  374.65,153.75 180 bottom
R11.5  1k  [R0805]  142.24,120.09 0 top
R11.6  10k  [R0805]  not placed on the board
R11.7  34k5  [R0805]  not placed on the board
R11.10  100  [R0805]  not placed on the board
R11.12  100  [R0805]  not placed on the board
R11.13  100  [R0805]  not placed on the board
R11.14  100k  [R0805]  not placed on the board
R11.15  1k  [R0805]  not placed on the board
R11.16  43.4k*  [R0805]  not placed on the board
R11.17  1k  [R0805]  not placed on the board
R11.18  1k  [R0805]  not placed on the board
R11F  20k*  [0207/10]  200.34,263.28 90 top  (outside the outline)
R11T  15k  [R0805]  239.71,237.88 0 bottom
R11T1  4k7  [R0805]  239.71,235.34 180 bottom
R12  10k  [R0805]  188.6,48.34 0 top
R12F  220k  [R0805]  192.72,260.11 0 top  (outside the outline)
R12T  4k3*  [R0805]  239.71,240.42 180 bottom
R13  1k  [0411/12]  not placed on the board
R13F  10k  [R0805]  193.68,269.95 0 top  (outside the outline)
R13T  91k  [R0805]  243.21,236.29 90 bottom
R13T1  340k  [R0805]  -122.24,138.5 180 bottom  (outside the outline)
R13T2  340k  [R0805]  -122.24,134.69 0 bottom  (outside the outline)
R14  1  [R1206]  not placed on the board
R14F  1M  [R0805]  199.71,262.65 270 top  (outside the outline)
R14T  200  [R0805]  243.21,239.79 270 bottom
R15  [0411/12]  not placed on the board
R15F  16k*  [0207/10]  184.47,256.93 0 top  (outside the outline)
R15T  47k  [R0805]  239.71,242.96 180 bottom
R16  10k  [R0805]  27.31,165.81 270 top
R16F  200k  [R0805]  180.66,260.11 0 top  (outside the outline)
R17  [PMA-A]  363.22,158.82 270 bottom
R17F  10k  [R0805]  181.61,269.95 0 top  (outside the outline)
R18  10k  [0411/12]  not placed on the board
R18F  1M  [R0805]  187.33,260.74 270 top  (outside the outline)
R19  120  [R0805]  not placed on the board
R19F  20k*  [0207/10]  171.45,256.93 0 top  (outside the outline)
R19F1  20k*  [0207/11]  162.24,231.53 90 top
R19F2  20k*  [0207/10]  145.42,256.93 0 top  (outside the outline)
R20  1k  [R0805]  not placed on the board
R20F  220k  [R0805]  168.59,260.11 0 top  (outside the outline)
R21  10k  [R0805]  385.13,63.89 90 top
R21F  10k  [R0805]  169.55,269.95 0 top  (outside the outline)
R22  47k  [R0805]  385.76,67.07 0 top
R22F  1M  [R0805]  175.26,260.74 270 top  (outside the outline)
R23  47k  [R0805]  390.21,67.07 0 top
R24  47k  [R0805]  394.65,67.07 0 top
R25  [0411/12]  not placed on the board
R26  10k  [R0805]  not placed on the board
R27  2k7  [R0805]  154.31,53.41 90 top
R28  2k7  [R0805]  149.23,53.41 90 top
R29  1k  [R0805]  154.31,48.97 90 top
R30  1k  [R0805]  149.23,48.97 90 top
R31  [0411/12]  138.43,19.12 0 top
R32  [0411/12]  138.43,5.79 0 top
R33  1k  [0411/12]  not placed on the board
R34  [0411/12]  not placed on the board
R35  [0411/12]  not placed on the board
R36  10k  [RTRIM3202]  not placed on the board
R37  10k  [RTRIM3202]  not placed on the board
R38  10k  [RTRIM3202]  not placed on the board
R39  5k1  [R0805]  not placed on the board
R40  5k1  [R0805]  not placed on the board
R41  [PMA-A]  not placed on the board
R42  5k1  [R0805]  not placed on the board
R43  10k  [R0805]  not placed on the board
R44  10k  [R0805]  not placed on the board
R45  1  [R1206]  619.12,-108.19 180 bottom  (outside the outline)
R46  12k  [R0805]  not placed on the board
R47  5k*  [R0805]  615.63,-113.59 90 bottom  (outside the outline)
R48  1  [R1206]  619.12,-105.34 180 bottom  (outside the outline)
R49  180  [R0805]  622.94,-109.15 270 bottom  (outside the outline)
R50  47k  [R0805]  not placed on the board
R51  56k*  [0207/10]  158.43,256.93 0 top  (outside the outline)
R52  75k*  [RTRIM3314GJ]  145.1,265.19 0 top  (outside the outline)
R53  20k*  [RTRIM3314G]  146.69,235.34 0 top
R54  1k2  [R0805]  not placed on the board
R55  560  [R0805]  not placed on the board
R56  5k*  [R0805]  not placed on the board
R57  [R0805]  63.82,152.16 180 bottom
R58  [R0805]  27.62,153.43 180 bottom
R59  [R0805]  40.64,178.51 90 bottom
R60  [R0805]  35.24,176.29 90 bottom
R61  [R0805]  37.47,177.56 90 bottom
R62  [R0603]  33.34,152.16 180 bottom
R63  [R0603]  37.47,152.16 0 bottom
R64  68  [R0805]  17.46,148.35 270 bottom
R65  1k  [R0805]  183.2,220.42 0 top
R66  120k  [R0805]  101.28,277.57 270 bottom  (outside the outline)
R67  1k  [R0805]  13.65,146.12 180 bottom
R68  [RTRIM3314GJ]  157.16,265.19 0 top  (outside the outline)
R69  1k  [R0805]  250.19,211.85 270 top
R70  11k*  [R0805]  102.55,280.43 0 bottom  (outside the outline)
R71  47k  [R0805]  101.28,289 270 bottom  (outside the outline)
R72  4k3*  [R0805]  103.82,285.51 0 bottom  (outside the outline)
R73  3k3  [R0805]  -46.99,75.32 270 bottom  (outside the outline)
R74  [R0805]  not placed on the board
R75  [R0805]  not placed on the board
R76  3k3  [R0805]  not placed on the board
R77  [0207/11]  -54.29,74.37 270 top  (outside the outline)
R78  [R0805]  -54.93,72.15 180 bottom  (outside the outline)
R79  20k  [RTRIM3314GJ]  193.36,265.19 0 top  (outside the outline)
R80  [RTRIM3314GJ]  181.29,265.19 0 top  (outside the outline)
R81  [RTRIM3314GJ]  169.23,265.19 0 top  (outside the outline)
R82  [0207/7]  not placed on the board
R101  560  [R0805]  389.18,41.27 0 bottom
R101*1  22k  [R0805]  not placed on the board
R101*11  10k  [R0805]  228.6,24.84 0 top
R101*12  10k  [R0805]  182.88,54.69 0 top
R101*13  10k  [R0805]  259.72,29.29 0 top
R101*14  10k  [R0805]  182.88,37.54 0 top
R101*-  22k  [R0805]  not placed on the board
R102  560  [R0805]  389.26,38.81 0 bottom
R102*-  180k  [R0805]  not placed on the board
R103  1k  [R0805]  394.34,36.91 90 bottom
R103-  2k2  [R0805]  not placed on the board
R105  510  [R0805]  397.51,34.37 0 bottom
R106  150  [R0805]  398.15,37.54 0 bottom
R107  3k  [R0805]  398.72,41 270 bottom
R108  5k1  [R0805]  389.26,35 180 bottom
R109  39.73k*  [0207/10]  367.03,35 180 top
R110  0  [R0805]  368.94,38.17 270 top
R111  3k  [R0805]  365.76,39.45 0 top
R112  100k*  [R0805]  372.75,40.72 180 top
R113  100k  [R0805]  372.11,44.52 90 top
R114  1k  [R0805]  374.65,44.52 270 top
R201  5k1  [R0805]  430.54,8.45 270 bottom
R202  5k1  [R0805]  462.32,11.68 90 bottom
R203  2k2  [R0805]  26.67,169.62 180 top
R204  2k2  [R0805]  26.67,172.16 180 top
R301  1  [R1206]  not placed on the board
R303  12k  [R0805]  not placed on the board
R304  3k9  [R0805]  not placed on the board
R310  47k0  [R0805]  498.22,101.5 90 bottom
R311  15k  [R0805]  498.22,96.5 90 bottom
R312  1k*  [R0805]  498.22,91.5 90 bottom
R313  1k*  [R0805]  494.72,91.5 90 bottom
R314  1k*  [R0805]  498.22,87 90 bottom
R315  10k  [R0805]  498.22,82.5 90 bottom
R316  10k  [R0805]  495.72,82.5 90 bottom
R901  [R0805]  375.29,126.76 270 top
R902  [R0805]  379.1,116.28 270 top
R903  [R0805]  368.62,110.88 180 top
R904  [R0805]  372.75,110.88 180 top
R905  [R0805]  376.87,110.88 0 top
R906  [R0805]  368.3,123.9 0 top
R907  [R0805]  366.4,116.28 270 top
R_SHUNT  [S]  not placed on the board
Rбесполезно1  10k  [R0805]  not placed on the board
Rнагр.  80ом для 8в.вх.  [R0805]  not placed on the board
T3  [1X01]  243.21,242.96 180 top
T10  [1X01]  240.98,230.9 180 top
TAHOIN  [1X01]  not placed on the board
TAHOIN1  [1X01]  not placed on the board
U$1  78L05F  [SOT89]  not placed on the board
U$2  [18650]  450.22,59.13 0 top
U$3  [DIMEN10X10]  49.53,193.75 0 top
U$14  TL432  [SOT-23]  not placed on the board
U$16  К176ИЕ5  [DIL14]  162.56,64.21 90 top
U$19  S  [S]  not placed on the board
U$23  PIN_D  [PIN_D3MM]  not placed on the board
U$24  PIN_D  [PIN_D3MM]  not placed on the board
U$30  T_PIN_NONAME  [PIN1X1N]  not placed on the board
U$32  T_PIN_NONAME  [PIN1X1N]  not placed on the board
U$33  T_PIN_NONAME  [PIN1X1N]  -62.55,57.54 270 top  (outside the outline)
U$34  T_PIN_NONAME  [PIN1X1N]  not placed on the board
U$35  T_PIN_NONAME  [PIN1X1N]  not placed on the board
VD1  SS12  [SMB]  not placed on the board
VD1M  SS34china  [SMB]  104.14,289 0 top  (outside the outline)
VD1P  SBL3040PT  [TO247H]  not placed on the board
VD1T  LL4148  [SOD80C]  223.36,319 270 bottom  (outside the outline)
VD2  sr5200  [SMB]  630.56,-115.81 270 bottom  (outside the outline)
VD2M  SS34china  [SMB]  103.82,275.03 270 top  (outside the outline)
VD2T  LL4148  [SOD80C]  not placed on the board
VD2T1  LL4148  [SOD80C]  not placed on the board
VD2T2  LL4148  [SOD80C]  237.17,221.69 180 bottom
VD2T3  LL4148  [SOD80C]  242.57,208.67 180 bottom
VD2T4  LL4148  [SOD80C]  181.93,225.5 0 top
VD2T5  LL4148  [SOD80C]  180.66,229.31 0 top
VD2T6  LL4148  [SOD80C]  not placed on the board
VD2T7  LL4148  [SOD80C]  not placed on the board
VD3M  SS34china  [SMB]  103.82,273.76 0 bottom  (outside the outline)
VD301  SS12  [SMB]  not placed on the board
VMETER_IN  [1X01]  498.22,106 0 top
VOUT  [1X01]  not placed on the board
VT1  [DPACK]  not placed on the board
VT1P  КТ203Б  [TO18]  not placed on the board
VT2  BJT_PNP_TO-92_ECB  [TO92]  not placed on the board
VT3  П306ОС  [TO92]  64.14,21.03 0 top
VT4  [SOT23]  14.61,149.3 90 bottom
VT5  BJT_PNP_TO-92_ECB  [TO92]  229.87,45.8 0 top
VT6  BJT_NPN_TO-92_ECB  [TO92]  184.15,62.94 0 top
VT7  BJT_NPN_TO-92_ECB  [TO92]  260.99,37.54 0 top
VT8  КТ315  [TO92]  375.29,122 180 top
VT9  КТ315  [TO92]  368.62,134.38 0 top
VT10  [SOT23]  not placed on the board
VT11  BJT_PNP_TO-92_ECB  [TO92]  not placed on the board
VT12  [TO92]  not placed on the board
VT13  [SOT23]  not placed on the board
VT14  [TO92]  147.96,59.13 90 top
VT15  [TO92]  153.04,59.13 90 top
VT16  2Т312В  [TO92]  not placed on the board
VT17  [TO92]  144.15,47.06 90 top
VT18  [TO92]  151.77,45.8 0 top
VT19  [TO92]  134.62,26.74 0 top
VT20  [TO92]  134.62,13.41 0 top
VT21  [TO92]  not placed on the board
VT22  [TO92]  not placed on the board
VT23  КТ502Е(88)  [TO92]  not placed on the board
VT24  [DPACK]  -60.01,80.09 270 bottom  (outside the outline)
VT25  [DPACK]  -60.01,72.15 270 bottom  (outside the outline)
X1  [182-009-MALE]  -28.44,156.47 270 top  (outside the outline)
Z2  32.768  [FC-12M]  18.33,166.14 90 top
Ш1  [R0805]  73.03,28.02 0 top